# Altium project Ada.PrjPcb
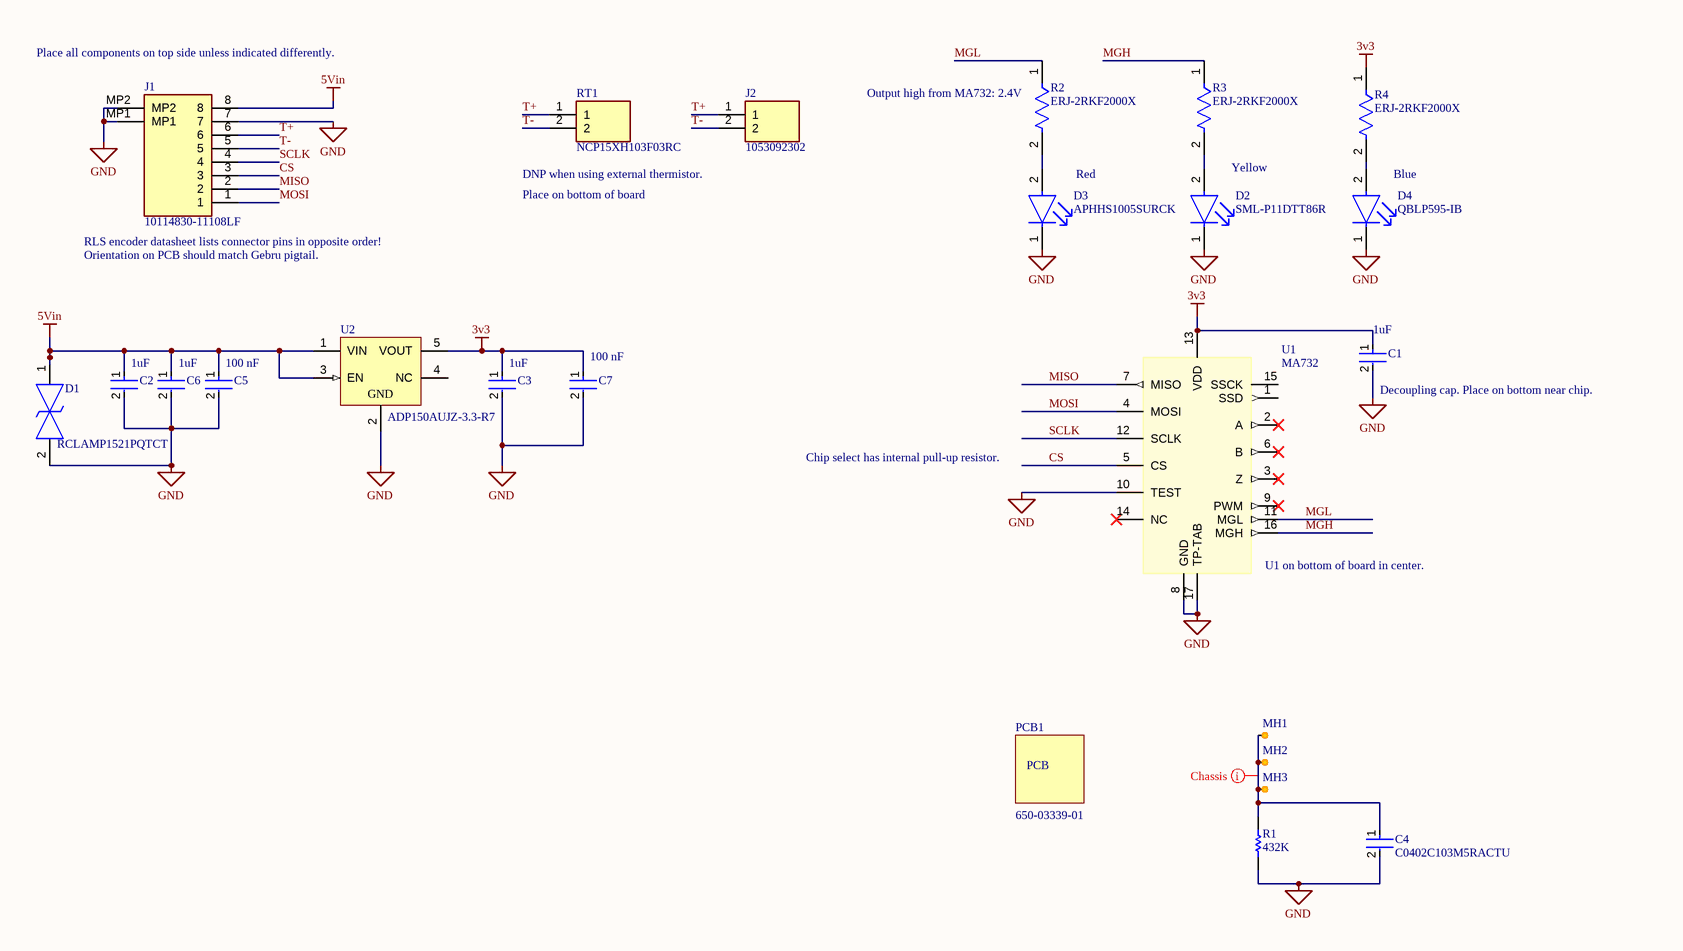
[diagram p0: Ada.SchDoc]
AssyPN: 650-03339-01; AssyRev: 01; AssyTitle1: MA732 based encoder board; DesDate: 2022-03-07; DistNum: 01; DraftDate: 2022-03-01; EngDate: 2022-03-16; GPN: 650-03339-01; NumberOfSheetsSch: 1; PCBPN: 650-03339-01; PCBRev: 03; PCBTitle1: MA732 based encoder board; Scientist_Name: ADA LOVELACE; Scientist_Name_Possessive: ADA LOVELACE'S
1 sheet, 24 parts. Net scope: global (net labels, ports and power ports of the same name join across sheets).
Board file: Ada.PcbDoc

## Sheet Ada.SchDoc
size 420 x 297 mm; PageSetup: Record=PageOptions|CenterHorizontal=True|CenterVertical=True|PrintScale=0.96|XCorrection=1.00|YCorrection=1.00|PrintKind=1|BorderSize=5000000|LeftOffset=0|BottomOffset=0|Orientation=2|PaperLength=4318|PaperWidth=2794|Scale=100|PaperSource=7|PrintQuality=600|MediaType=1|DitherType=10|PaperKind=11" x 17"|PrintScaleMode=1; SheetNumber: 1; SheetTotal: 1; PROJECT_NAME: Ada MA732 based encoder board; GPN_PCBA: 650-03339-01; GPN_PCBA_REV: 1

### Parts
C1  Capacitance: 1uF  [FP-CL03-IPC_A]  (hidden comment: CL03A105MQ3CSNC)
C2  Capacitance: 1uF  [FP-CL03-IPC_A]  (hidden comment: CL03A105MQ3CSNC)
C3  Capacitance: 1uF  [FP-CL03-IPC_A]  (hidden comment: CL03A105MQ3CSNC)
C4  C0402C103M5RACTU  [FP-C0402-BB-MFG]
C5  value 100 nF  [FP-CC0402-MFG]  (hidden comment: CC0402KRX5R9BB104)
C6  Capacitance: 1uF  [FP-CL03-IPC_A]  (hidden comment: CL03A105MQ3CSNC)
C7  value 100 nF  [FP-CC0402-MFG]  (hidden comment: CC0402KRX5R9BB104)
D1  RCLAMP1521PQTCT  [RCLAMP1521PQTCT]
D2  SML-P11DTT86R  [FP-SML-P11-MFG]
D3  APHHS1005SURCK  [FP-APHHS1005SURCK-MFG]
D4  QBLP595-IB  [FP-QBLP595-IB-MFG]
J1  10114830-11108LF  [1011483011108LF]
J2  1053092302  [105309YY02_U]
MH1  MH  [MH_1.6MM]  (value not drawn)  (no BOM)
MH2  MH  [MH_1.6MM]  (value not drawn)  (no BOM)
MH3  MH  [MH_1.6MM]  (value not drawn)  (no BOM)
PCB1  ItemNumber: 650-03339-01  (hidden comment: PCB)  (mechanical)
R1  432K  [RESC1005X40X25NL05T10]
R2  ERJ-2RKF2000X  [FP-ERJ2RK-IPC_A]
R3  ERJ-2RKF2000X  [FP-ERJ2RK-IPC_A]
R4  ERJ-2RKF2000X  [FP-ERJ2RK-IPC_A]
RT1  NCP15XH103F03RC  [THRMC1005X55N]
U1  Mfg P/N: MA732  [QFN50P300X300X100-16-TP]  (hidden comment: SENSOR_MPS_MA732)
U2  ADP150AUJZ-3.3-R7  [ADI-UJ-5_M]

### Nets
3v3: C1.1 C3.1 C7.1 R4.1 U1.13(VDD) U2.5(VOUT)
5Vin: C2.1 C5.1 C6.1 D1.1 J1.8 U2.1(VIN) U2.3(EN)
GND: C1.2 C2.2 C3.2 C4.2 C5.2 C6.2 C7.2 D1.2 D2.1(C) D3.1(C) D4.1(C) J1.7 J1.MP1 J1.MP2 R1.1 U1.8(GND) U1.10(TEST) U1.17(TP-TAB) U2.2(GND)
CS: J1.3 U1.5(CS)
MGH: R3.1 U1.16(MGH)
MGL: R2.1 U1.11(MGL)
MISO: J1.2 U1.7(MISO)
MOSI: J1.1 U1.4(MOSI)
SCLK: J1.4 U1.12(SCLK)
T+: J1.6 J2.1 RT1.1
T-: J1.5 J2.2 RT1.2
NetC4_1: C4.1 MH1.1 MH2.1 MH3.1 R1.2
NetD2_2: D2.2(A) R3.2
NetD3_2: D3.2(A) R2.2
NetD4_2: D4.2(A) R4.2

Not connected (* = marked no-connect by the designer): U1 1(SSD) 2(A)* 3(Z)* 6(B)* 9(PWM)* 14(NC)* 15(SSCK); U2 4(NC)

### Layout directives
net class Chassis: NetC4_1

### Notes on the sheet
- (near J1) Place all components on top side unless indicated differently.
- (near R2) Output high from MA732: 2.4V
- DNP when using external thermistor.
- Place on bottom of board
- Red
- Yellow
- Blue
- (near J1) RLS encoder datasheet lists connector pins in opposite order!
- (near J1) Orientation on PCB should match Gebru pigtail.
- (near C1) Decoupling cap. Place on bottom near chip.
- Chip select has internal pull-up resistor.
- (near U1) U1 on bottom of board in center.
- CREATIVE COMMONS
- PUBLIC LICENSE:
- BARKOUR ROBOT
- CC BY-NC 4.0
- APPROVED
- DWG NO
- GOOGLE LLC
- FILE
- RELEASED
- 2024/05/09
- SIZE
- 1600 AMPHITHEATRE PARKWAY
- MOUNTAIN VIEW CA 94043
- A3
- SHEET
- OF
- THIS DESIGN IS BEING PROVIDED  FOR NON-COMMERCIAL USE ONLY. THE USE OF =SCIENTIST_NAME_POSSESSIVE NAME IN CONNECTION WITH THE DESIGN IS NOT INTENDED TO IMPLY THAT =SCIENTIST_NAME SPONSORS OR ENDORSES THE DESIGN, GOOGLE LLC, OR ANY OF GOOGLE LLC'S PRODUCTS OR SERVICES.

### Library data of the parts
C1-C3 C6 = CMP-13271-003873-1: Cap Ceramic 1uF 6.3V X5R ±20% Pad SMD 0201 +85°C T/R; Lead Free: Lead Free; Packaging: Tape and Reel; Dielectric: X5R; Voltage Rating: 6.3V; Case Code (Imperial): 0201; Max Operating Temperature: 85°C; Case/Package: 0201; Tolerance: 20%; Depth: 0.3mm; Width: 0.012inch; Thickness: 0.013inch; Length: 0.024inch; Case Code (Metric): 0603; Package Quantity: 1; Min Operating Temperature: -55°C; Mount: Surface Mount
C4 = CMP-1034-01887-3: CAP CER 10000PF 50V 20% X7R 0402; Manufacturer: Kemet; Value: 10,000 pF; Tolerance: 0.2; Temperature Coefficient: 15%; Material: Ceramic; Temperature Range Low: -55°C; Digikey Description: CAP CER 10000PF 50V 20% X7R 0402; Temperature Characteristic: X7R; Device Class L2: Capacitors; RoHS: TRUE; Temperature Range High: +125°C; Mouser Description: Cap Ceramic 0.01uF 50V X7R 20% SMD 1.0 x 0.5 mm 125 C Paper T/R; Package: C0402-BB; ComponentLink2URL: https://content.kemet.com/datasheets/KEM_C1002_X7R_SMD.pdf; Device Class L1: Passive Components; ComponentLink2Description: Datasheet; Height: 0.55mm; Automotive: No; Temperature: -55°C to +125°C; Capacitance: 10,000 pF; Manufacturer Part Number: C0402C103M5RACTU; Device Class L3: Ceramic Capacitors; Voltage Rating: 50 V; Ipc Land Pattern Name: CAPC10050X50; Category: Cap; Octopart: https://octopart.com/c0402c103m5ractu-kemet-17125571; Lead Free: Yes
C5 C7 = CMP-03422-000742-1: CAP CER 0.1UF 50V X5R 0402; Manufacturer: YAGEO; Automotive Grade: NA; Tolerance: 0.1; Temperature Coefficient: 30ppm/°C; Material: Ceramic; Temperature Range Low: -55°C; Height: 0.55mm; Device Class L2: Capacitors; Footprint Url: http://www.yageo.com/exep/pages/download/literatures/UPY-C_GEN_24.pdf; ComponentLink2Description: Datasheet; Device Class L1: Passive Components; Voltage Rating: 50 V; Category: Cap; Lead Free: Yes; Digikey Description: CAP CER 0.1UF 50V X5R 0402; Temperature Characteristic: X5R; Device Class L3: Ceramic Capacitors; RoHS: TRUE; Manufacturer Part Number: CC0402KRX5R9BB104; Temperature Range High: +125°C; Package: CC0402; Capacitance: 100 nF; Ipc Land Pattern Name: CAPC10050X50; Octopart: https://octopart.com/cc0402krx5r9bb104-yageo-33978688; ComponentLink2URL: http://www.yageo.com/documents/recent/UPY-GP_NP0_16V-to-50V_16.pdf; Temperature: -55°C to +125°C; Automotive: No
D1 = RCLAMP1521PQTCT: TVS Diode (Bi-directional); Manufacturer_Name: SEMTECH; Datasheet Link: https://www.arrow.com/en/products/rclamp1521pqtct/semtech; Height: 0.55mm; Manufacturer_Part_Number: RCLAMP1521PQTCT; Mouser Part Number: 947-RCLAMP1521PQTCT; Mouser Price/Stock: https://www.mouser.co.uk/ProductDetail/Semtech/RCLAMP1521PQTCT/?qs=rBWM4%252BvDhIejX164RfHkPw%3D%3D; Arrow Part Number: RCLAMP1521PQTCT; Arrow Price/Stock: https://www.arrow.com/en/products/rclamp1521pqtct/semtech
D2 = CMP-08952-000022-1: LED ORANGE CLEAR 1006 SMD; Manufacturer: Rohm; Forward Current: 1mA; Wavelength: 605nm; Reverse Voltage: 5V; Power Dissipation: 52mW; Led Orientation: Top View; Luminous Intensity: 7.3mcd; Forward Voltage: 1.9V; Mouser Description: LED Uni-Color Orange 2-Pin Chip 0402(1006Metric) T/R; RoHS: TRUE; Temperature: -40°C to +85°C; Package: SML-P11; Manufacturer Part Number: SML-P11DTT86R; Automotive: No; Digikey Description: LED ORANGE CLEAR 1006 SMD; Lead Free: Yes; Octopart: https://octopart.com/sml-p11dtt86r-rohm-34112313; Temperature Range Low: -40°C; Device Class L2: LEDs; Device Class L3: unset; Height: 0.25mm; Temperature Range High: +85°C; Device Class L1: Optoelectronics; ComponentLink2URL: https://d1d2qsbl8m0m72.cloudfront.net/en/products/databook/datasheet/opto/led/chip_mono/sml-p11-e.pdf; Colour: Orange; Category: Diode; ComponentLink2Description: Datasheet
D3 = CMP-2000-05787-2: LED RED CLEAR CHIP SMD; Forward Current: 20mA; Number of LEDs: 1; Dominant Wavelength: 630nm; Luminous Intensity: 220mcd; Wavelength: 635nm; Forward Voltage: 1.95V; Viewing Angle: 120°; Case/Package: 0402; Length: 1mm; Packaging: Tape and Reel; Lens Color: Clear; Width: 0.5mm; Test Current: 20mA; Lead Free: Lead Free; Min Operating Temperature: -40°C; Illumination Color: Red; Max Operating Temperature: 85°C; Mount: Surface Mount; Package Quantity: 2000; Lens Style: Clear; Case Code (Imperial): 0402; Height: 0.6mm; Number of Pins: 2; Case Code (Metric): 1005; Color: Red
D4 = CMP-113271-000002-1: LED BLUE CLEAR 0402 SMD; Lens Size: 0.5mm; Dominant Wavelength: 465nm; Forward Voltage: 3.1V; Lens Color: Colorless; Luminous Intensity: 85mcd; Test Current: 20mA; Viewing Angle: 140°; Lens Style: Flat; Width: 0.5mm; Case Code (Metric): 1005; Lens Transparency: Clear; Color: Blue; Packaging: Tape and Reel; Case Code (Imperial): 0402; Mount: Surface Mount; Length: 1mm; Case/Package: 0402; Height: 0.6mm
J1 = 10114830-11108LF: Connector; Manufacturer_Name: Amphenol; Datasheet Link: https://cdn.amphenol-icc.com/media/wysiwyg/files/drawing/10114830.pdf; Height: 3.4mm; Manufacturer_Part_Number: 10114830-11108LF; Mouser Part Number: 649-10114830-11108LF; Mouser Price/Stock: https://www.mouser.co.uk/ProductDetail/Amphenol-FCI/10114830-11108LF?qs=SqJKR5Mmryf8jaiAqFrwwQ%3D%3D
J2 = 1053092302: Connector; Manufacturer_Name: Molex; Datasheet Link: https://www.molex.com/pdm_docs/sd/1053091102_sd.pdf; Height: 10.51mm; Manufacturer_Part_Number: 1053092302
MH1-MH3 = 144: MOUNTING HOLE, M1.6, 4.0mm PAD; ID: 144; Status: Released
PCB1 = 110: ID: 110; Level: 1; FindNumber: 010; Org: ORG - REP; Type: PCB; GPN: 650-03339-01; Status: In Development; MFG P/N: 650-03339-01; PROXY: 650-03339-01; Type: 651-PCB; ProductLine: Proxy
R1 = CMP-2002-07684-1: Part Number: RC0402FR-07432KL; Manufacturer: Yageo
R2-R4 = CMP-2002-00757-2: RES SMD 200 OHM 1% 1/10W 0402; Power Rating: 100mW; Voltage Rating (DC): 50V; Resistance: 200R; Temperature Coefficient: 100ppm/°C; RoHS Compliant: Yes; Packaging: Tape and Reel; Case Code (Metric): 1005; Package Quantity: 1; Contact Plating: Tin; Series: ERJ; Mount: Surface Mount; Lead Free: Lead Free; Min Operating Temperature: -55°C; Number of Terminations: 2; Max Power Dissipation: 100mW; Technology: THICK FILM; Voltage Rating: 50V; Case/Package: 0402; Width: 0.02inch; Termination: SMD/SMT; Military Standard: Not; Height: 0.35mm; Radiation Hardening: No; Resistance Tolerance: 1%; Length: 1mm; REACH SVHC: No SVHC; Construction: Rectangular; Depth: 0.5mm; Features: Automotive AEC-Q200; Resistor Type: Thick Film; Case Code (Imperial): 0402; Tolerance: 1%; Size Code: 0402; Max Operating Temperature: 155°C
RT1 = NCP15XH103F03RC: Thermistor; Manufacturer_Name: Murata Electronics; Datasheet Link: https://datasheet.datasheetarchive.com/originals/distributors/Datasheets_SAMA/616ff9b704eea4ec1739d2fdac2a983c.pdf; Height: 0.55mm; Manufacturer_Part_Number: NCP15XH103F03RC; Mouser Part Number: 81-NCP15XH103F03RC; Mouser Price/Stock: https://www.mouser.co.uk/ProductDetail/Murata-Electronics/NCP15XH103F03RC?qs=fKZN0AlWj%2F2mA3qn9WuQPw%3D%3D; Arrow Part Number: NCP15XH103F03RC; Arrow Price/Stock: https://www.arrow.com/en/products/ncp15xh103f03rc/murata-manufacturing?region=nac
U1 = 165: SENSOR, ANGLE, 9 BIT TO 14 BIT RESOLUTION, 14-BIT PWM OUTPUT, 3.3V, 12mA, QFN-16; ID: 165; Mfg: MPS; SENSOR TYPE: Angle Sensor; Status: Released; Package: QFN-16; Category: Sensors; RoHS Compliant: Yes; Mounting Type: Surface Mount; HEIGHT (MAX): 1mm; OPERATING TEMPERATURE: -40°C to +125°C; VOLTAGE - SUPPLY: 3.3V; ComponentLink1Description: Datasheet; ComponentLink1URL: https://www.monolithicpower.com/en/documentview/productdocument/index/version/2/document_type/Datasheet/lang/en/sku/MA732/document_id/5009/; Height: 1mm
U2 = CMP-0786-00394-1: Ultralow Noise, 150 mA CMOS Linear Regulator, 2.2 to 5.5 V Vin, 3.3 V Vout, Industrial, 5-pin SOT23 (UJ-5), Reel; Manufacturer: Analog Devices; Supply Current IGND @ Small Load: 10uA; Vin (min) (V): 2.2; Iout max: 150mA; Preset Vout Values (V): 3.3; Vin (max) (V): 5.5; ComponentLink2Description: Datasheet; PackageReference: UJ-5; DatasheetVersion: Rev. A; PackageDescription: 5-Pin Thin Small Outline Transistor Package, Body 2.9 x 1.6 mm, Pitch 0.95 mm; ComponentLink4URL: Product URL:http://www.analog.com/en/ADP150/productSearch.html; Packing: Reel; ComponentLink1URL: http://www.analog.com/en/index.html; PartNumber: ADP150AUJZ-3.3-R7; PackageVersion: 100708-A, 10/2008; ComponentLink3Description: Package Specification; ComponentLink3URL: http:/www.analog.com/static/imported-files/packages/PKG_PDF/TSOT(UJ)/UJ_5.pdf; ComponentLink4Description: URL Link1; ComponentLink2URL: http://www.analog.com/static/imported-files/data_sheets/ADP150.pdf; Code_JEDEC: MO-193-AB; Mounting Technology: Surface Mount; ComponentLink1Description: Manufacturer URL

## Assembly variants
PCBA: not fitted J2 R1 RT1